# EasyEDA Pro project ProProject_AT32_FOC_2024-04-27.epro, board AS5600
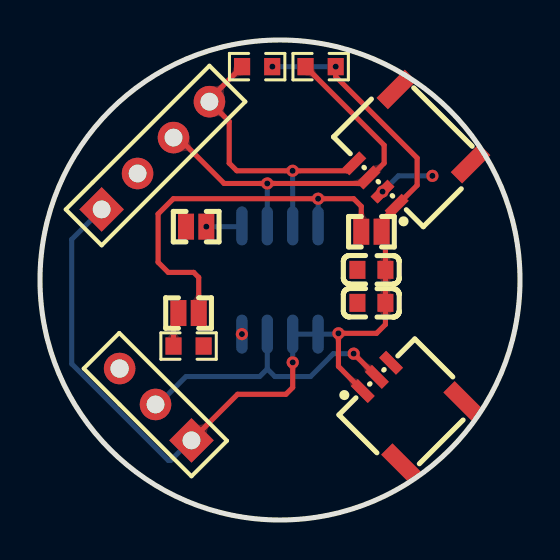
[diagram p4: board, top side]
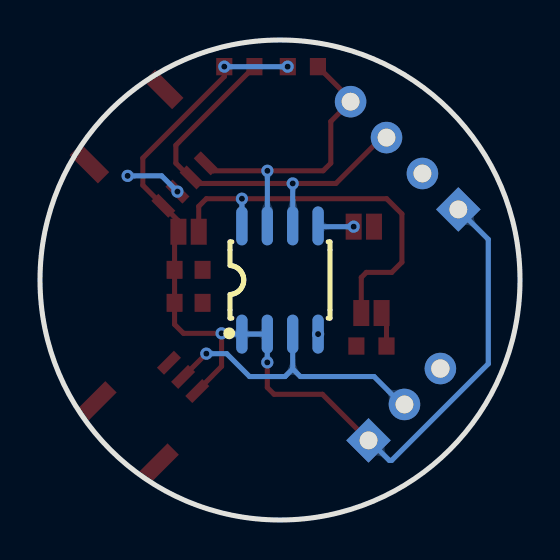
[diagram p5: board, bottom side, seen from below]

Outline 24 x 24 mm; copper layers: Top Layer, Bottom Layer. Coordinates in mm from the lower left corner of the outline.
Outline path: circle c12,12 r12
Stack: Top Layer 0.035mm / Dielectric1 1.51mm FR4 er 4.5 / Bottom Layer 0.035mm

## Design rules (mm)
template: JLCPCB Capability(Two Layers Board)
spacing copperThickness1oz (default): track to track 0.102, other pairs 0.152 to 0.3
spacing copperThickness2oz: track to track 0.203, other pairs 0.152 to 0.3
track width copperThickness1oz (default): min 0.127, default 0.254, max 2.54
track width copperThickness2oz: min 0.203, default 0.254, max 2.54
differential pair differentialPair (default): width min 0.127, default 0.254, max 2.54; gap min 0.152, default 0.152
via viaSize (default): diameter min 0.5, default 0.61, max 10; hole min 0.3, default 0.305, max 6.3

## Placement (name value [footprint] x y rotation side)
C1  100nf  [C0603]  16.57 10.86 0 top
C2  10u  [C0603]  16.57 12.51 0 top
CN1  HDGC1002WR-S-4P  [CONN-SMD_4P-P1.00_HDGC_HDGC1002WR-S-4P]  18.22 18.22 135 top
CN2  HDGC1002WR-S-3P  [CONN-SMD_3P-P1.00_HDGC_HDGC1002WR-S-3P]  18.22 5.78 45 top
H1  HDR-F-2.54_1x3  [HDR-F-2.54_1X3]  5.78 5.78 135 top
J1  HDR-M-2.54_1x4  [HDR-M-2.54_1X4]  5.78 18.22 45 top
NO1  -  [短路连接点]  7.81 14.67 180 top
NO2  -  [短路连接点]  7.43 10.35 0 top
NO3  -  [短路连接点]  16.57 14.41 180 top
R1  4.7k  [R0603]  10.86 22.67 0 top
R2  4.7k  [R0603]  14.03 22.67 0 top
R3  10K  [R0603]  7.43 8.7 180 top
U1  AS5600-ASOM  [SOIC-8_L5.0-W4.0-P1.27-LS6.0-BL]  12 12 180 bottom

## Footprints (pads in the part's own frame, mm; a bottom-side part is the same pattern mirrored in y, then rotated)
C0603
  rect 0.8x0.9 smd: 1(-0.7,0) 2(0.7,0)
CONN-SMD_3P-P1.00_HDGC_HDGC1002WR-S-3P
  rect 0.5x1.2 smd: 1(-1,1.95) 2(0,1.95) 3(1,1.95)
  rect 0.8x2 smd: 4(2.2,-1.95) 5(-2.2,-1.95)
CONN-SMD_4P-P1.00_HDGC_HDGC1002WR-S-4P
  rect 0.5x1.2 smd: 1(-1.5,2.05) 2(-0.5,2.05) 3(0.5,2.05) 4(1.5,2.05)
  rect 0.8x2 smd: 5(2.624,-2.05) 6(-2.625,-2.05)
HDR-F-2.54_1X3
  rect 1.575x1.575 hole 0.889: 1(-2.54,0)
  round 1.575 hole 0.889: 2(0,0)
  round 1.575 hole 0.914: 3(2.54,0)
HDR-M-2.54_1X4
  rect 1.575x1.575 hole 0.889: 1(-3.81,0)
  round 1.575 hole 0.889: 2(-1.27,0) 3(1.27,0) 4(3.81,0)
R0603
  rect 0.806x0.864 smd: 1(-0.753,0) 2(0.753,0)
SOIC-8_L5.0-W4.0-P1.27-LS6.0-BL
  oval 0.569x1.95 smd: 1(-1.905,-2.705) 2(-0.635,-2.705) 3(0.635,-2.705) 4(1.905,-2.705) 5(1.905,2.705) 6(0.635,2.705) 7(-0.635,2.705) 8(-1.905,2.705)
短路连接点
  rect 0.8x1.3 smd: 1(-0.508,0) 2(0.508,0)

## Nets
As in the schematic.

## Via types
v1: diameter 0.61, hole 0.305, Top Layer to Bottom Layer, 12 vias

## Routing (per net, layer and track width the routed paths; a pad name or vN(x,y) marks a point on that pad's centre or on a via; arc(x,y) is an arc through that point)
+3.3V: length 52.3
  Top Layer w0.254: CN2.1 14.92,7.68 v1(14.92,9.33) 16.83,9.33 17.27,9.78 C1.2 C2.2 17.27,14.22 NO3.1 17.08,14.96 CN1.1 18.86,16.74 18.86,18.1 14.79,22.17 v1(14.79,22.67) ; v1(12.64,7.88) 12.64,6.63 12.29,6.28 9.88,6.28 7.57,3.98
  Bottom Layer w0.254: 3.08,15.53 1.59,14.03 1.59,7.81 6.41,2.98 6.54,2.98 7.54,3.98 7.57,3.98 ; v1(14.79,22.67) v1(11.62,22.67) ; v1(12.64,7.88) 12.64,9.3 U1.1 14.88,9.3 v1(14.92,9.33)
GND: length 2.8
  Bottom Layer w0.254: v1(19.62,17.21) 17.91,17.21 v1(17.13,16.42)
  vias: v1(10.09,9.3)
DIR: length 19.8
  Top Layer w0.254: NO3.2 16.06,15.68 15.68,16.06 v1(13.91,16.06) 6.67,16.06 5.9,15.3 5.9,12.89 6.41,12.38 7.68,12.38 7.94,12.13 NO2.2
  Bottom Layer w0.254: U1.8 v1(13.91,16.06)
NO2_1: length 1.8
  Top Layer w0.254: R3.2 6.67,10.1 NO2.1
OUT: length 14.7
  Top Layer w0.254: v1(15.68,8.32) CN2.2
  Bottom Layer w0.254: H1.2 5.9,5.78 7.3,7.17 10.98,7.17 11.37,7.55 ; 11.37,7.55 11.75,7.17 13.52,7.17 14.67,8.32 v1(15.68,8.32) ; 11.37,7.55 U1.3
SCL: length 15.2
  Top Layer w0.254: R1.1 8.47,21.04 J1.4 9.46,19.93 9.46,17.84 9.84,17.46 v1(12.63,17.46) 15.34,17.46 CN1.4
  Bottom Layer w0.254: v1(12.63,17.46) 12.64,14.7
SDA: length 20.5
  Top Layer w0.254: R2.1 17.21,18.74 17.21,17.84 16.49,17.13 CN1.3 16.12,16.83 v1(11.37,16.83) 9.21,16.83 6.91,19.12 J1.3
  Bottom Layer w0.254: v1(11.37,16.83) U1.6
U1_5: length 1.8
  Bottom Layer w0.254: U1.5 10.06,14.67 v1(8.32,14.67)

## Copper pours and planes (outline as drawn; the poured copper is in the pictures)
GND on Top Layer: 25.82,12.35 25.78,13.07 25.71,13.78 25.6,14.49 25.45,15.19 25.26,15.89 25.04,16.57 24.78,17.24 24.49,17.9 24.16,18.54 23.8,19.16 23.41,19.76 22.99,20.34 22.54,20.9 22.06,21.43 21.55,21.94 21.02,22.42 20.46,22.87 19.88,23.3 19.27,23.69 18.65,24.05 18.01,24.37 17.36,24.66 16.69,24.92 16,25.14 15.31,25.33 14.61,25.48 13.9,25.59 13.18,25.67 12.47,25.7 11.75,25.7 11.03,25.67 10.32,25.59 9.61,25.48 8.9,25.33 8.21,25.14 7.53,24.92 6.86,24.66 6.2,24.37 5.56,24.05 4.94,23.69 4.34,23.3 3.75,22.87 3.2,22.42 2.66,21.94 2.16,21.43 1.67,20.9 1.22,20.34 0.8,19.76 0.41,19.16 0.05,18.54 -0.28,17.9 -0.57,17.24 -0.83,16.57 -1.05,15.89 -1.23,15.19 -1.38,14.49 -1.5,13.78 -1.57,13.07 -1.61,12.35 -1.61,11.63 -1.57,10.91 -1.5,10.2 -1.38,9.49 -1.23,8.79 -1.05,8.09 -0.83,7.41 -0.57,6.74 -0.28,6.08 0.05,5.44 0.41,4.82 0.8,4.22 1.22,3.64 1.67,3.08 2.16,2.55 2.66,2.04 3.2,1.56 3.75,1.11 4.34,0.68 4.94,0.29 5.56,-0.07 6.2,-0.39 6.86,-0.68 7.53,-0.94 8.21,-1.16 8.9,-1.35 9.61,-1.5 10.32,-1.61 11.03,-1.69 11.75,-1.72 12.47,-1.72 13.18,-1.69 13.9,-1.61 14.61,-1.5 15.31,-1.35 16,-1.16 16.69,-0.94 17.36,-0.68 18.01,-0.39 18.65,-0.07 19.27,0.29 19.88,0.68 20.46,1.11 21.02,1.56 21.55,2.04 22.06,2.55 22.54,3.08 22.99,3.64 23.41,4.22 23.8,4.82 24.16,5.44 24.49,6.08 24.78,6.74 25.04,7.41 25.26,8.09 25.45,8.79 25.6,9.49 25.71,10.2 25.78,10.91 25.82,11.63
GND on Bottom Layer: 25.84,12.35 25.8,13.07 25.73,13.78 25.61,14.49 25.46,15.2 25.28,15.89 25.06,16.58 24.8,17.25 24.51,17.9 24.18,18.55 23.82,19.17 23.43,19.77 23.01,20.35 22.55,20.91 22.07,21.45 21.56,21.96 21.03,22.44 20.47,22.89 19.89,23.31 19.28,23.7 18.66,24.06 18.02,24.39 17.36,24.68 16.69,24.94 16.01,25.16 15.31,25.35 14.61,25.5 13.9,25.61 13.18,25.69 12.47,25.72 11.75,25.72 11.03,25.69 10.31,25.61 9.6,25.5 8.9,25.35 8.2,25.16 7.52,24.94 6.85,24.68 6.19,24.39 5.55,24.06 4.93,23.7 4.33,23.31 3.74,22.89 3.18,22.44 2.65,21.96 2.14,21.45 1.66,20.91 1.21,20.35 0.78,19.77 0.39,19.17 0.03,18.55 -0.29,17.9 -0.59,17.25 -0.84,16.58 -1.07,15.89 -1.25,15.2 -1.4,14.49 -1.51,13.78 -1.59,13.07 -1.63,12.35 -1.63,11.63 -1.59,10.91 -1.51,10.2 -1.4,9.49 -1.25,8.78 -1.07,8.09 -0.84,7.4 -0.59,6.73 -0.29,6.08 0.03,5.43 0.39,4.81 0.78,4.21 1.21,3.63 1.66,3.07 2.14,2.53 2.65,2.02 3.18,1.54 3.74,1.09 4.33,0.67 4.93,0.28 5.55,-0.08 6.19,-0.41 6.85,-0.7 7.52,-0.96 8.2,-1.18 8.9,-1.37 9.6,-1.52 10.31,-1.63 11.03,-1.71 11.75,-1.74 12.47,-1.74 13.18,-1.71 13.9,-1.63 14.61,-1.52 15.31,-1.37 16.01,-1.18 16.69,-0.96 17.36,-0.7 18.02,-0.41 18.66,-0.08 19.28,0.28 19.89,0.67 20.47,1.09 21.03,1.54 21.56,2.02 22.07,2.53 22.55,3.07 23.01,3.63 23.43,4.21 23.82,4.81 24.18,5.43 24.51,6.08 24.8,6.73 25.06,7.4 25.28,8.09 25.46,8.78 25.61,9.49 25.73,10.2 25.8,10.91 25.84,11.63

Small or netless copper shapes (teardrops, artwork), in the pictures only: 33 on Top Layer, 24 on Bottom Layer
